# EasyEDA Pro project ProPrj_HTXStudio_OneHanded_Keyboard.epro, schematic 鼠标滚轮_小尺寸
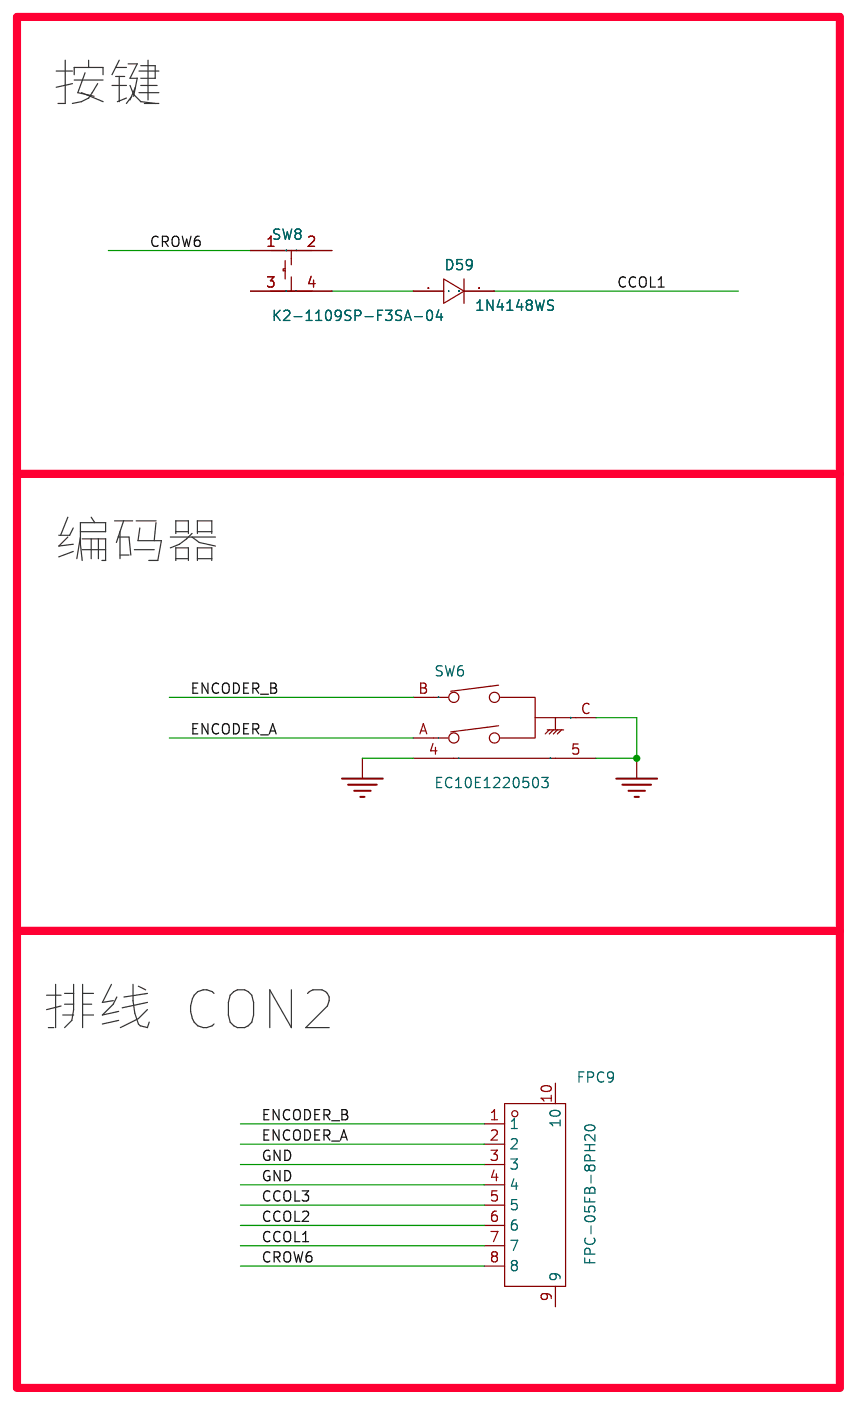
[diagram p9: schematic sheet]

## Parts
D59  1N4148WS  [SOD-323_L1.8-W1.3-LS2.5-RD]
FPC9  FPC-05FB-8PH20  [FPC-SMD_8P-P0.50_XUNPU_FPC-05FB-8PH20]
SW6  EC10E1220503  [SW-TH_EC10EXXXXXXX]
SW8  K2-1109SP-F3SA-04  [SW-SMD_4P-L4.5-W4.5-P3.00-LS7.0]

## Library data of the parts
D59 = 1N4148WS_C437156: 二极管配置:独立式;正向压降(Vf):1.25V@150mA;直流反向耐压(Vr):100V;整流电流:150mA;反向恢复时间(trr):4ns;; LCSC Part Name: 电压:100V 电流:150mA; Supplier Part: C437156; Manufacturer: MDD(辰达半导体); Supplier Footprint: SOD-323; JLCPCB Part Class: 扩展库; Datasheet: https://atta.szlcsc.com/upload/public/pdf/source/20230823/12C4B88004F768DBC940AB716F9D26AA.pdf; Supplier: LCSC; Diode Configuration: 独立式; Forward Voltage (Vf@If): 1.25V@150mA; Reverse Voltage (Vr): 100V; Rectified Current: 150mA; Reverse Leakage Current: 25nA@20V; Reverse Recovery Time (trr): 4ns; Operating Temperature: -55℃~+150℃@(Tj)
FPC9 = FPC-05FB-8PH20: 锁定特性:翻盖式;触点类型:双侧触点/上下接;触点数量:8P;间距:0.5mm;安装类型:卧贴;工作温度范围:-25℃~+85℃;; LCSC Part Name: 间距:0.5mm P数:8P 翻盖式 双侧触点/上下接; Supplier Part: C2856828; Manufacturer: XUNPU(讯普); Supplier Footprint: SMD,P=0.5mm,卧贴; JLCPCB Part Class: 扩展库; Datasheet: https://atta.szlcsc.com/upload/public/pdf/source/20210922/C2856828_96968FB666CC1781EEE4F204CBA73B0B.pdf; Supplier: LCSC; Locking Feature: 翻盖式; Contact Type: 双侧触点/上下接; Number of Contacts: 8P; Pitch: 0.5mm; Mounting Type: 卧贴; FFC, FCB Thickness: 0.3mm; Height Above Board: 2mm; Operating Temperature Range: -25℃~+85℃
SW6 = EC10E1220503: Supplier Part: C110291; Manufacturer: ALPSALPINE(阿尔卑斯阿尔派); Supplier Footprint: 插件; JLCPCB Part Class: 扩展库; Datasheet: https://atta.szlcsc.com/upload/public/pdf/source/20170428/1493376811855.pdf; Supplier: LCSC
SW8 = K2-1109SP-F3SA-04: 作用力:180gf;安装方式:立贴;开关长度:4.5mm;开关宽度:4.5mm;开关高度:6mm;触点电流:50mA;额定电压(DC):12V;绝缘电阻:100MΩ;机械寿命:10万次;; LCSC Part Name: 4.5*4.5*6 贴片轻触开关180G; Supplier Part: C2685971; Manufacturer: 韩国韩荣; Supplier Footprint: SMD; JLCPCB Part Class: Extended Part; Datasheet: https://atta.szlcsc.com/upload/public/pdf/source/20210810/49845446EAD3BCAD35997B0365C3ACCB.pdf; Supplier: LCSC; Operating Force: 180gf; Mounting Style: 立贴; Switch Length: 4.5mm; Switch Width: 4.5mm; Switch Height: 6mm; Contact Current: 50mA; Voltage Rating (DC): 12V; Insulation Resistance: 100MΩ; Mechanical Life: 10万次; Operating Temperature: -25℃~+85℃

## Nets
GND: FPC9.3 FPC9.4 SW6.4 SW6.5 SW6.C
CCOL1: D59.1(C) FPC9.7
CCOL2: FPC9.6
CCOL3: FPC9.5
CROW6: FPC9.8 SW8.1
ENCODER_A: FPC9.2 SW6.A
ENCODER_B: FPC9.1 SW6.B
$1N347: D59.2(A) SW8.4

Not connected (* = marked no-connect by the designer): FPC9 9 10; SW8 2 3

## Notes on the sheet
- 按键
- 编码器
- 排线 CON2
